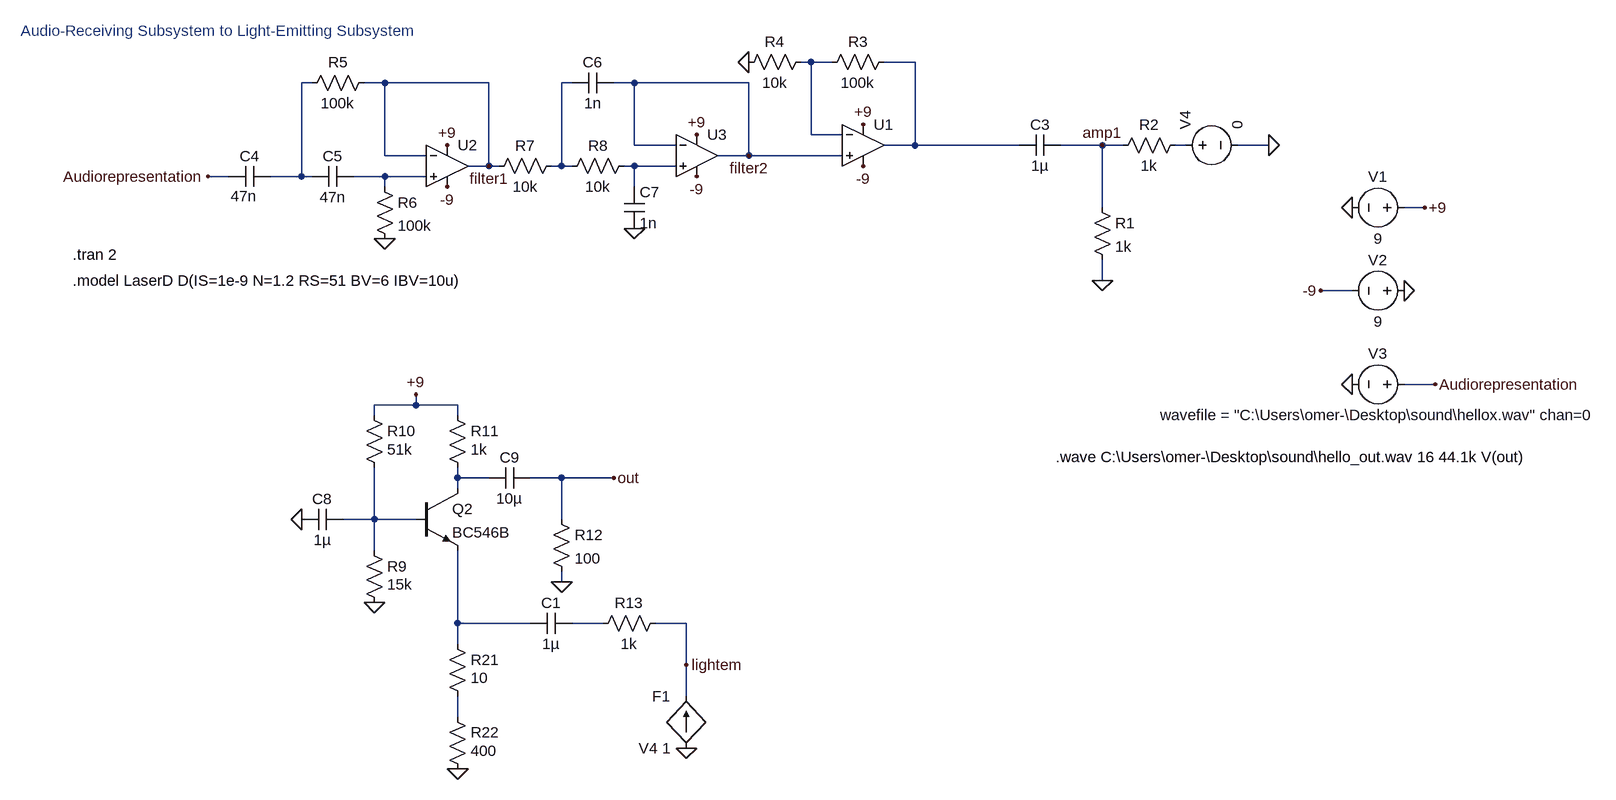
[diagram p0: schematic project_sound_success.asc]
project_sound_success.asc, the LTspice schematic file:
Version 4
SHEET 1 1288 1092
WIRE 32 -432 16 -432
WIRE 64 -432 32 -432
WIRE 192 -432 144 -432
WIRE -736 -400 -752 -400
WIRE -624 -400 -656 -400
WIRE -464 -400 -624 -400
WIRE -336 -400 -352 -400
WIRE -240 -400 -272 -400
WIRE -64 -400 -240 -400
WIRE 32 -320 32 -432
WIRE 80 -320 32 -320
WIRE -240 -304 -240 -400
WIRE -176 -304 -240 -304
WIRE 192 -304 192 -432
WIRE 192 -304 144 -304
WIRE 352 -304 192 -304
WIRE 480 -304 416 -304
WIRE 512 -304 480 -304
WIRE 608 -304 592 -304
WIRE 736 -304 688 -304
WIRE -624 -288 -624 -400
WIRE -560 -288 -624 -288
WIRE -64 -288 -64 -400
WIRE -64 -288 -112 -288
WIRE 80 -288 -64 -288
WIRE -464 -272 -464 -400
WIRE -464 -272 -496 -272
WIRE -448 -272 -464 -272
WIRE -352 -272 -352 -400
WIRE -352 -272 -368 -272
WIRE -336 -272 -352 -272
WIRE -240 -272 -256 -272
WIRE -176 -272 -240 -272
WIRE -864 -256 -896 -256
WIRE -752 -256 -752 -400
WIRE -752 -256 -800 -256
WIRE -736 -256 -752 -256
WIRE -624 -256 -672 -256
WIRE -560 -256 -624 -256
WIRE -624 -240 -624 -256
WIRE -240 -240 -240 -272
WIRE 480 -208 480 -304
WIRE 976 -208 944 -208
WIRE 480 -96 480 -128
WIRE 864 -80 816 -80
WIRE 992 64 944 64
WIRE -576 96 -576 80
WIRE -576 96 -640 96
WIRE -512 96 -576 96
WIRE -640 112 -640 96
WIRE -512 112 -512 96
WIRE -512 208 -512 192
WIRE -464 208 -512 208
WIRE -352 208 -400 208
WIRE -272 208 -352 208
WIRE -512 224 -512 208
WIRE -640 272 -640 192
WIRE -640 272 -688 272
WIRE -576 272 -640 272
WIRE -352 272 -352 208
WIRE -640 320 -640 272
WIRE -352 368 -352 352
WIRE -512 432 -512 320
WIRE -400 432 -512 432
WIRE -288 432 -336 432
WIRE -160 432 -208 432
WIRE -512 464 -512 432
WIRE -160 496 -160 432
WIRE -160 544 -160 496
WIRE -512 576 -512 544
FLAG 112 -336 +9
FLAG 112 -272 -9
FLAG -64 -432 0
FLAG -624 -160 0
FLAG -528 -304 +9
FLAG -144 -320 +9
FLAG -144 -256 -9
FLAG -528 -240 -9
FLAG -240 -176 0
FLAG -640 400 0
FLAG -576 80 +9
FLAG -512 656 0
FLAG -160 624 0
FLAG -896 -256 Audiorepresentation
FLAG 736 -304 0
FLAG 864 -208 0
FLAG 944 -80 0
FLAG 864 64 0
FLAG 976 -208 +9
FLAG 816 -80 -9
FLAG 992 64 Audiorepresentation
FLAG -352 368 0
FLAG -272 208 out
FLAG -464 -272 filter1
FLAG -64 -288 filter2
FLAG 480 -304 amp1
FLAG 480 -96 0
FLAG -160 496 lightem
FLAG -752 272 0
SYMBOL cap 416 -320 R90
WINDOW 0 0 32 VBottom 2
WINDOW 3 32 32 VTop 2
SYMATTR InstName C3
SYMATTR Value 1µ
SYMBOL OpAmps\\UniversalOpAmp2 112 -304 R0
SYMATTR InstName U1
SYMBOL res 160 -448 R90
WINDOW 0 0 56 VBottom 2
WINDOW 3 32 56 VTop 2
SYMATTR InstName R3
SYMATTR Value 100k
SYMBOL res -80 -416 R270
WINDOW 0 32 56 VTop 2
WINDOW 3 0 56 VBottom 2
SYMATTR InstName R4
SYMATTR Value 10k
SYMBOL cap -800 -240 M270
WINDOW 0 32 32 VTop 2
WINDOW 3 -14 61 VLeft 2
SYMATTR InstName C4
SYMATTR Value 47n
SYMBOL cap -672 -272 R90
WINDOW 0 0 32 VBottom 2
WINDOW 3 32 32 VTop 2
SYMATTR InstName C5
SYMATTR Value 47n
SYMBOL res -640 -416 R90
WINDOW 0 0 56 VBottom 2
WINDOW 3 32 56 VTop 2
SYMATTR InstName R5
SYMATTR Value 100k
SYMBOL res -640 -256 R0
SYMATTR InstName R6
SYMATTR Value 100k
SYMBOL OpAmps\\UniversalOpAmp2 -528 -272 R0
SYMATTR InstName U2
SYMBOL OpAmps\\UniversalOpAmp2 -144 -288 R0
SYMATTR InstName U3
SYMBOL res -352 -288 R90
WINDOW 0 0 56 VBottom 2
WINDOW 3 32 56 VTop 2
SYMATTR InstName R7
SYMATTR Value 10k
SYMBOL cap -272 -416 R90
WINDOW 0 0 32 VBottom 2
WINDOW 3 32 32 VTop 2
SYMATTR InstName C6
SYMATTR Value 1n
SYMBOL cap -256 -240 R0
SYMATTR InstName C7
SYMATTR Value 1n
SYMBOL res -240 -288 R90
WINDOW 0 0 56 VBottom 2
WINDOW 3 32 56 VTop 2
SYMATTR InstName R8
SYMATTR Value 10k
SYMBOL cap -688 256 R90
WINDOW 0 0 32 VBottom 2
WINDOW 3 32 32 VTop 2
SYMATTR InstName C8
SYMATTR Value 1µ
SYMBOL res -656 304 R0
WINDOW 3 36 68 Left 2
SYMATTR Value 15k
SYMATTR InstName R9
SYMBOL res -656 96 R0
WINDOW 3 36 68 Left 2
SYMATTR Value 51k
SYMATTR InstName R10
SYMBOL res -528 96 R0
WINDOW 3 36 68 Left 2
SYMATTR Value 1k
SYMATTR InstName R11
SYMBOL npn -576 224 R0
SYMATTR InstName Q2
SYMATTR Value BC546B
SYMBOL cap -400 192 R90
WINDOW 0 0 32 VBottom 2
WINDOW 3 32 32 VTop 2
SYMATTR InstName C9
SYMATTR Value 10µ
SYMBOL res -528 448 R0
WINDOW 3 36 68 Left 2
SYMATTR Value 10
SYMATTR InstName R21
SYMBOL res -528 560 R0
WINDOW 3 36 68 Left 2
SYMATTR Value 400
SYMATTR InstName R22
SYMBOL voltage 960 -208 R90
WINDOW 0 -32 56 VBottom 2
WINDOW 3 32 56 VTop 2
WINDOW 123 0 0 Left 0
WINDOW 39 0 0 Left 0
SYMATTR InstName V1
SYMATTR Value 9
SYMBOL voltage 960 -80 R90
WINDOW 0 -32 56 VBottom 2
WINDOW 3 32 56 VTop 2
WINDOW 123 0 0 Left 0
WINDOW 39 0 0 Left 0
SYMATTR InstName V2
SYMATTR Value 9
SYMBOL voltage 960 64 R90
WINDOW 0 -32 56 VBottom 2
WINDOW 3 32 56 VTop 2
WINDOW 123 0 0 Left 0
WINDOW 39 0 0 Left 0
SYMATTR InstName V3
SYMATTR Value wavefile = "C:\Users\omer-\Desktop\sound\hellox.wav" chan=0
SYMBOL voltage 592 -304 R270
WINDOW 123 0 0 Left 0
WINDOW 39 0 0 Left 0
SYMATTR InstName V4
SYMATTR Value 0
SYMBOL f -160 624 R180
WINDOW 0 24 80 Left 2
WINDOW 3 24 0 Left 2
SYMATTR InstName F1
SYMATTR Value V4 1
SYMBOL res -368 256 R0
SYMATTR InstName R12
SYMATTR Value 100
SYMBOL res 464 -224 R0
SYMATTR InstName R1
SYMATTR Value 1k
SYMBOL res 608 -320 R90
WINDOW 0 0 56 VBottom 2
WINDOW 3 32 56 VTop 2
SYMATTR InstName R2
SYMATTR Value 1k
SYMBOL res -192 416 R90
WINDOW 0 0 56 VBottom 2
WINDOW 3 32 56 VTop 2
SYMATTR InstName R13
SYMATTR Value 1k
SYMBOL cap -336 416 R90
WINDOW 0 0 32 VBottom 2
WINDOW 3 32 32 VTop 2
SYMATTR InstName C1
SYMATTR Value 1µ
TEXT -1104 -136 Left 2 !.tran 2
TEXT -1104 -96 Left 2 !.model LaserD D(IS=1e-9 N=1.2 RS=51 BV=6 IBV=10u)
TEXT -1184 -480 Left 2 ;Audio-Receiving Subsystem to Light-Emitting Subsystem
TEXT 408 176 Left 2 !.wave C:\\Users\\omer-\\Desktop\\sound\\hello_out.wav 16 44.1k V(out)

The netlist it stands for:
* project_sound_success.asc
C3 amp1 N002 1µ
XU1 filter2 N001 +9 -9 N002 level2 Avol=1Meg GBW=10Meg Slew=10Meg Ilimit=25m Rail=0 Vos=0 En=0 Enk=0 In=0 Ink=0 Rin=500Meg  ; pins In+ In- V+ V- OUT
R3 N002 N001 100k
R4 0 N001 10k
C4 N003 Audiorepresentation 47n
C5 N007 N003 47n
R5 filter1 N003 100k
R6 N007 0 100k
XU2 N007 filter1 +9 -9 filter1 level2 Avol=1Meg GBW=10Meg Slew=10Meg Ilimit=25m Rail=0 Vos=0 En=0 Enk=0 In=0 Ink=0 Rin=500Meg  ; pins In+ In- V+ V- OUT
XU3 N006 filter2 +9 -9 filter2 level2 Avol=1Meg GBW=10Meg Slew=10Meg Ilimit=25m Rail=0 Vos=0 En=0 Enk=0 In=0 Ink=0 Rin=500Meg  ; pins In+ In- V+ V- OUT
R7 N004 filter1 10k
C6 filter2 N004 1n
C7 N006 0 1n
R8 N006 N004 10k
C8 N009 0 1µ
R9 N009 0 15k
R10 +9 N009 51k
R11 +9 N008 1k
Q2 N008 N009 N010 0 BC546B
C9 out N008 10µ
R21 N010 N012 10
R22 N012 0 400
V1 +9 0 9
V2 0 -9 9
V3 Audiorepresentation 0 wavefile = "C:\Users\omer-\Desktop\sound\hellox.wav" chan=0
V4 N005 0 0
F1 0 lightem V4 1
R12 out 0 100
R1 amp1 0 1k
R2 N005 amp1 1k
R13 lightem N011 1k
C1 N011 N010 1µ
.model NPN NPN
.model PNP PNP
.lib standard.bjt
.tran 2
.model LaserD D(IS=1e-9 N=1.2 RS=51 BV=6 IBV=10u)
* Audio-Receiving Subsystem to Light-Emitting Subsystem
.wave C:\Users\omer-\Desktop\sound\hello_out.wav 16 44.1k V(out)
.lib UniversalOpAmp2.lib
.backanno
.end